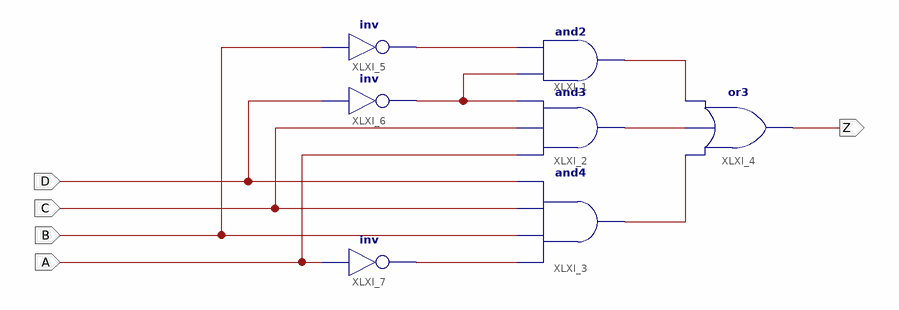
[diagram p0: schematic sheet 1]
// Xilinx ISE schematic c0a.sch (spartan3) as structural Verilog: 7 symbols, 5 ports
module c0a (
  input  A,
  input  B,
  input  C,
  input  D,
  output Z
);

  wire XLXN_1, XLXN_2, XLXN_3, XLXN_5, XLXN_6, XLXN_7;

  and XLXI_1 (XLXN_1, XLXN_6, XLXN_5);
  and XLXI_2 (XLXN_2, A, C, XLXN_6);
  and XLXI_3 (XLXN_3, XLXN_7, B, C, D);
  or XLXI_4 (Z, XLXN_3, XLXN_2, XLXN_1);
  not XLXI_5 (XLXN_5, B);
  not XLXI_6 (XLXN_6, D);
  not XLXI_7 (XLXN_7, A);
endmodule
